# Altium schematic sheet ThermoE.SchDoc
size A4; SheetNumber: 2; SheetTotal: 3
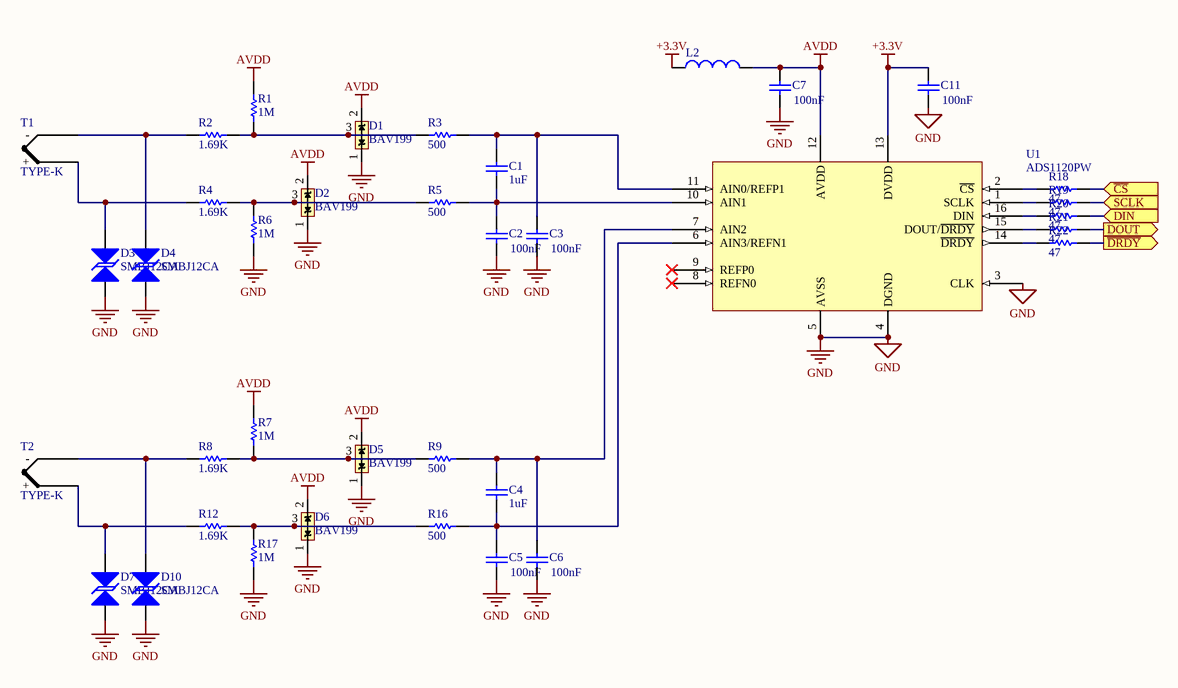
[diagram p0: ThermoE.SchDoc]

## Parts
C1  1uF  [c603]
C2  100nF  [c603]
C3  100nF  [c603]
C4  1uF  [c603]
C5  100nF  [c603]
C6  100nF  [c603]
C7  100nF  [C603]
C11  100nF  [C603]
D1  BAV199  [SOT-23]
D2  BAV199  [SOT-23]
D3  SMBJ12CA  [DO-214AA]
D4  SMBJ12CA  [DO-214AA]
D5  BAV199  [SOT-23]
D6  BAV199  [SOT-23]
D7  SMBJ12CA  [DO-214AA]
D10  SMBJ12CA  [DO-214AA]
L2  1K  [r805]  (value not drawn)
R1  1M  [R0603]
R2  1.69K  [R0603]
R3  500  [R0603]
R4  1.69K  [R0603]
R5  500  [R0603]
R6  1M  [R0603]
R7  1M  [R0603]
R8  1.69K  [R0603]
R9  500  [R0603]
R12  1.69K  [R0603]
R16  500  [R0603]
R17  1M  [R0603]
R18  47  [R0603]
R19  47  [R0603]
R20  47  [R0603]
R21  47  [R0603]
R22  47  [R0603]
T1  TYPE-K  [PCC-SMP]
T2  TYPE-K  [PCC-SMP]
U1  ADS1120PW  [TSSOP-16]

## Ports
DIN (in), DOUT (out), SCLK (in), ~{CS} (in), ~{DRDY} (out)

## Nets
+3.3V: C11.2 L2.1 U1.13(DVDD)
AVDD: C7.2 D1.2(K2) D2.2(K2) D5.2(K2) D6.2(K2) L2.2 R1.2 R7.2 U1.12(AVDD)
GND: C2.1 C3.1 C5.1 C6.1 C7.1 C11.1 D1.1(A1) D2.1(A1) D3.1(A) D4.1(A) D5.1(A1) D6.1(A1) D7.1(A) D10.1(A) R6.1 R17.1 U1.3(CLK) U1.4(DGND) U1.5(AVSS)
~{CS}: R18.1 ; port ~{CS}
~{DRDY}: R22.1 ; port ~{DRDY}
DIN: R20.1 ; port DIN
DOUT: R21.1 ; port DOUT
SCLK: R19.1 ; port SCLK
NetC1_1: C1.1 C2.2 R5.1 U1.10(AIN1)
NetC1_2: C1.2 C3.2 R3.1 U1.11(AIN0/REFP1)
NetC4_1: C4.1 C5.2 R16.1 U1.6(AIN3/REFN1)
NetC4_2: C4.2 C6.2 R9.1 U1.7(AIN2)
NetD1_3: D1.3(C) R1.1 R2.1 R3.2
NetD2_3: D2.3(C) R4.1 R5.2 R6.2
NetD3_2: D3.2(K) R4.2 T1.2(+)
NetD4_2: D4.2(K) R2.2 T1.1(-)
NetD5_3: D5.3(C) R7.1 R8.1 R9.2
NetD6_3: D6.3(C) R12.1 R16.2 R17.2
NetD7_2: D7.2(K) R12.2 T2.2(+)
NetD10_2: D10.2(K) R8.2 T2.1(-)
NetR18_2: R18.2 U1.2(~{CS})
NetR19_2: R19.2 U1.1(SCLK)
NetR20_2: R20.2 U1.16(DIN)
NetR21_2: R21.2 U1.15(DOUT/~{DRDY})
NetR22_2: R22.2 U1.14(~{DRDY})

Not connected (* = marked no-connect by the designer): U1 8(REFN0)* 9(REFP0)*

## Library data of the parts
C1-C7 C11 = Cap: Capacitor; Designer: Parsa Malekpour
  C1 C4: Value: 1uF
  C2 C3 C5-C7 C11: Value: 100nF
D3 D4 D7 D10 = SMBJxxCA: Surface Mount Transient Voltage Suppressors Diode; Parameter 1: *
L2 = Ferrite Bead: Code_IEC: 1005; Published: 8-Jun-2000; LatestRevisionDate: 29-May-2009; LatestRevisionNote: IPC-7351 Footprint Added.; Publisher: Altium Limited; PackageDescription: Chip Inductor; Code_JEITA: 0402; Value: 1K
R1-R9 R12 R16-R22 = Resistor: Designer: Parsa Malekpour
  R1 R6 R7 R17: Value: 1M
  R2 R4 R8 R12: Value: 1.69K
  R3 R5 R9 R16: Value: 500
  R18-R22: Value: 47
T1 T2 = THERMOCOUPLE
U1 = ADS1120PW: ADS1120 4-Channel, 2-kSPS, Low-Power, 16-Bit ADC with Integrated PGA and Reference